# Altium schematic sheet DC_DCConverter.SchDoc
size 420 x 297 mm; Address1: Address1; Address2: Address2; Address3: Address3; Address4: Address4; SheetNumber: 1; Scale: 1:1; Разраб.: Иванов; Обозначение документа: АБВГ.123456.001 Э3; Пров.: Петров; Утв.: Сидоров; Наименование организации: ОАО "Концерн "МПО-Гидроприбор"; Перв. применение: АБВГ.123456.000; Наименование изделия 1: Плата; Наименование изделия 2: Схема электрическая; Наименование изделия 3: принципиальная; Нач. отд.: Нач. отд.; Фамилия нач. отд.: Сидоров
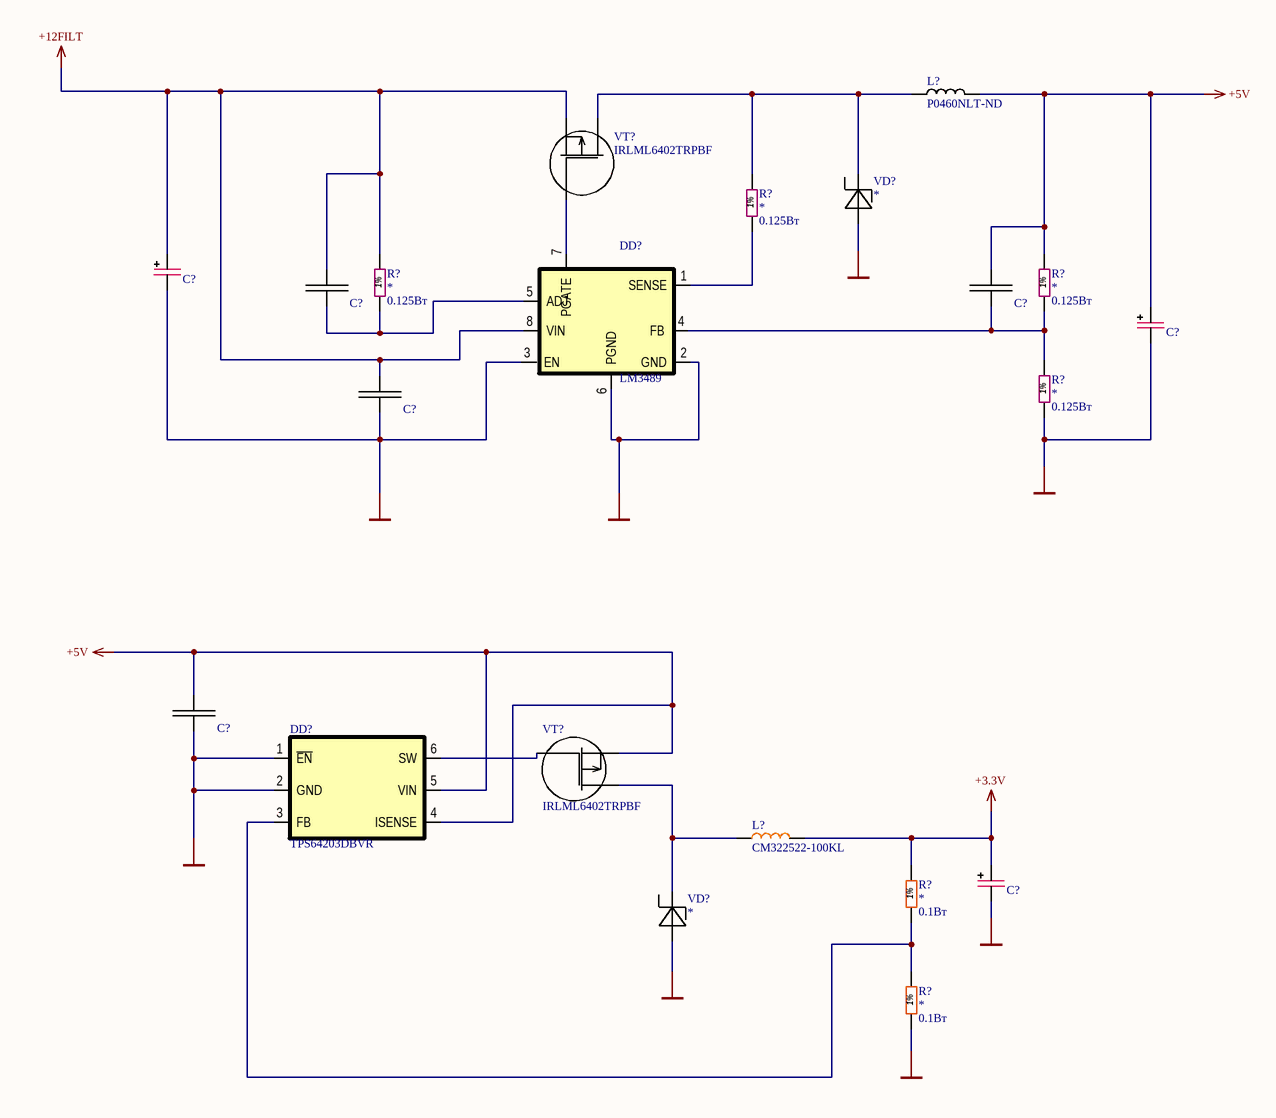
[diagram p0: DC_DCConverter.SchDoc]

## Parts
(Parts that share a designator on the sheet are numbered #1, #2 ... from top to bottom, then left to right.)
C?#1  22uF  [D6.6C6.6H6.1]  (value not drawn)
C?#2  *  [CH0805C]  (value not drawn)
C?#3  *  [CH0805C]  (value not drawn)
C?#4  *  [D6.6C6.6H6.1]  (value not drawn)
C?#5  *  [CH0805C]  (value not drawn)
C?#6  *  [CH0805C]  (value not drawn)
C?#7  *  [D6.6C6.6H6.1]  (value not drawn)
DD?#1  LM3489  [8-SSOP]
DD?#2  TPS64203DBVR  [SOT-23-6]
L?#1  P0460NLT-ND  [PG0936]
L?#2  CM322522-100KL  [1210]
R?#1  Power: 0.125Вт  [RES0805]  (hidden comment: *)
R?#2  Power: 0.125Вт  [RES0805]  (hidden comment: *)
R?#3  Power: 0.125Вт  [RES0805]  (hidden comment: *)
R?#4  Power: 0.125Вт  [RES0805]  (hidden comment: *)
R?#5  Power: 0.1Вт  [Res0603]  (hidden comment: *)
R?#6  Power: 0.1Вт  [Res0603]  (hidden comment: *)
VD?#1  *  [DO-214(SMB)]
VD?#2  *  [DO-214(SMB)]
VT?#1  IRLML6402TRPBF  [SOT23-3]
VT?#2  IRLML6402TRPBF  [SOT23-3]

## Nets
+3.3V: C?#7.1 L?#2.2(GND) R?#5.2
+5V: C?#3.1 C?#4.1 C?#6.1 DD?#2.4(ISENSE) DD?#2.5(VIN) L?#1.2(GND) R?#3.2 VT?#2.2(Source)
+12FILT: C?#1.1 C?#2.1 C?#5.1 DD?#1.8(VIN) R?#2.2 VT?#1.2(Source)
GND: C?#1.2 C?#4.2 C?#5.2 C?#6.2 C?#7.2 DD?#1.2(GND) DD?#1.3(EN) DD?#1.6(PGND) DD?#2.1(~{EN}) DD?#2.2(GND) R?#4.1 R?#6.1 VD?#1.1 VD?#2.1
NetC?#2_2: C?#2.2 DD?#1.5(ADJ) R?#2.1
NetC?#3_2: C?#3.2 DD?#1.4(FB) R?#3.1 R?#4.2
NetDD?#1_1: DD?#1.1(SENSE) R?#1.1
NetDD?#1_7: DD?#1.7(PGATE) VT?#1.1(G)
NetDD?#2_3: DD?#2.3(FB) R?#5.1 R?#6.2
NetDD?#2_6: DD?#2.6(SW) VT?#2.1(G)
NetL?#1_1: L?#1.1(SENSE) R?#1.2 VD?#1.2 VT?#1.3(D)
NetL?#2_1: L?#2.1(SENSE) VD?#2.2 VT?#2.3(D)

## Notes on the sheet
- Перв. примен.
- Справ. №
- Подп. и дата
- Инв. № дубл.
- Взам. инв. №
- Разраб.
- Изм.
- Лист
- № докум.
- Подп.
- Дата
- Лит.
- Масса
- Масштаб
- Пров.
- Т.контр.
- Листов
- Инв. № подл.
- Утв.
- Н.контр.
- Копировал
- Формат А3

## Library data of the parts
C?#1 = Electrolitich_Capasitor: Part Number: ECAPSMD22uF/35V; Manufacturer: EPCOS; Voltage: 35V; Value: 22uF; Quantity: 50; Package: 6.3x5.4; Price: 0,25; ShoppingPlace: https://www.ru-chipdip.by/product0/20423?from=payattention_visited
C?#2 C?#3 C?#5 C?#6 = Capasitor: Value: *; Voltage: *; Part Number: *; Quantity: *; Package: *; Price: *; Manufacturer: *; ShoppingPlace: *
C?#4 C?#7 = Electrolitich_Capasitor: Value: *; Voltage: *; Part Number: *; Quantity: *; Package: *; Price: *; Manufacturer: *; ShoppingPlace: *
DD?#1 = LM3489: Manufacturer: Texas Instruments; Part Number: LM3489; ShoppingPlace: https://www.digikey.com/product-detail/en/texas-instruments/LM3489MMX-NOPB/296-35277-6-ND/3739282; Package: 8-TSSOP; Quantity: 1; Tolerance: *; Type: IC; Voltage: *; Power: *; Documentation: http://www.ti.com/lit/ds/symlink/lm3489.pdf
DD?#2 = TPS64203DBVR: Manufacturer: Texas Instruments; Part Number: TPS64203DBVR; ShoppingPlace: https://www.digikey.com/product-detail/en/texas-instruments/TPS64203DBVR/296-27036-2-ND/1672405; Package: SOT-23-6; Quantity: 1; Tolerance: *; Type: IC; Voltage: *; Power: *; Documentation: http://www.ti.com/lit/ds/symlink/tps64200.pdf
L?#1 = PG0936.253NL: Manufacturer: Pulse Electronics Power; Type: L; Part Number: PG0936.253NL; ShoppingPlace: https://www.digikey.com/product-detail/en/pulse-electronics-power/PG0936.253NL/553-3154-ND/5436640; Package: PG0936.253NL; Quantity: 1; Tolerance: *; Voltage: *; Power: *; Documentation: https://media.digikey.com/pdf/Data%20Sheets/Pulse%20PDFs/Ros1,2_Series.pdf
L?#2 = CM322522-100KL: Manufacturer: Bourns; Value: 10uГн; Tolerance: +-10%; Type: L; Power: 140mA; Part Number: CM322522-100KL; Price: 0,35; ShoppingPlace: https://www.ru-chipdip.by/product/cm322522-100kl; Package: 1210; Quantity: 1; Voltage: *; Documentation: http://www.farnell.com/datasheets/2360599.pdf
R?#1-R?#4 = Res0805_1%: Voltage: 150В; Tolerance: 1%; Manufacturer: *; Quntity: *; Price: *; Part Number: *; Package: 0805; Doc: *; Value: *
R?#5 R?#6 = Res0603_1%: Voltage: 50В; Tolerance: 1%; Manufacturer: *; Quntity: *; Price: *; Part Number: *; Package: 0603; Doc: *; Value: *
VD?#1 VD?#2 = Basic_Diode_shottki: Part Number: *; Package: *; Value: *; Price: *; ShoppingPlace: *; Documantation: *
VT?#1 VT?#2 = IRLML6402: Manufacturer: International rectifier; Value: -20V,0,065Om; Package: SOT-23; Price: 0,17; Part Number: IRLML6402TRPBF; Quantity: 1; Documentation: https://www.infineon.com/dgdl/irlml6402pbf.pdf?fileId=5546d462533600a401535668d5c2263c